# Altium schematic sheet Sheet2.SchDoc
size A3
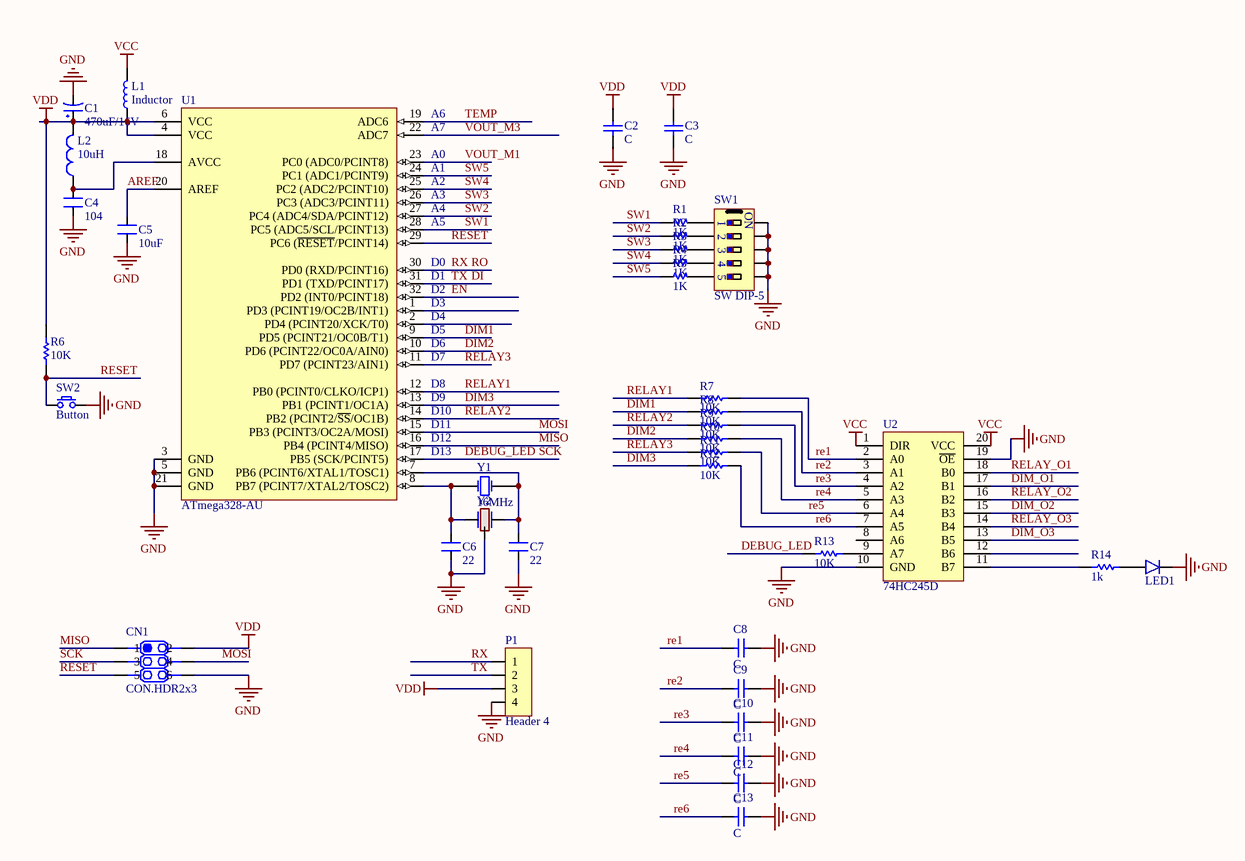
[diagram p0: Sheet2.SchDoc]

## Parts
C1  470uF/16V  [WCAP-PSHP 8x8.7x3.1]
C2  C  [C 0805 (2012)]
C3  C  [C 0805 (2012)]
C4  104  [R 0805 (2012)]
C5  10uF  [R 0805 (2012)]
C6  22  [C 0805 (2012)]
C7  22  [C 0805 (2012)]
C8  C  [C 0805]
C9  C  [C 0805]
C10  C  [C 0805]
C11  C  [C 0805]
C12  C  [C 0805]
C13  C  [C 0805]
CN1  CON.HDR2x3  [Header 3x2]
L1  Inductor  [Inductor SMD 0805 (2012)]
L2  10uH  [R 0805 (2012)]
LED1  Led  [Led SMD 0805]  (value not drawn)
P1  Header 4  [Header 4]
R1  1K  [R 0805]
R2  1K  [R 0805]
R3  1K  [R 0805]
R4  1K  [R 0805]
R5  1K  [R 0805]
R6  10K  [R 0805 (2012)]
R7  10K  [R 0805 (2012)]
R8  10K  [R 0805 (2012)]
R9  10K  [R 0805 (2012)]
R10  10K  [R 0805 (2012)]
R11  10K  [R 0805 (2012)]
R12  10K  [R 0805 (2012)]
R13  10K  [R 0805 (2012)]
R14  1k  [R 0805 (2012)]
SW1  SW DIP-5  [SW/DIP5/300]
SW2  Button  [SW/2/SMD]
U1  ATmega328-AU  [QFP32N]
U2  74HC245D  [SOIC-20]
Y1  16MHz  [XTAL]
Y2  (no value)  [Crystal SMD CSTCE]

## Nets
GND: C1.2 C2.2 C3.2 C4.1 C5.1 C6.1 C7.1 C8.2 C9.2 C10.2 C11.2 C12.2 C13.2 CN1.6 LED1.2(K) P1.4 SW1.6 SW1.7 SW1.8 SW1.9 SW1.10 SW2.2 U1.3(GND) U1.5(GND) U1.21(GND) U2.10(GND) U2.19(~{OE}) Y2.2
VCC: L1.2 U2.1(DIR) U2.20(VCC)
VDD: C1.1 C2.1 C3.1 CN1.2 L1.1 L2.2 P1.3 R6.2 U1.4(VCC) U1.6(VCC)
AREF: C5.2 U1.20(AREF)
DEBUG_LED: CN1.3 R13.1 U1.17(PB5_(SCK/PCINT5))  [also labelled SCK]
DI: P1.2 U1.31(PD1_(TXD/PCINT17))  [also labelled TX]
DIM1: R8.1 U1.9(PD5_(PCINT21/OC0B/T1))
DIM2: R10.1 U1.10(PD6_(PCINT22/OC0A/AIN0))
DIM3: R12.1 U1.13(PB1_(PCINT1/OC1A))
DIM_O1: U2.17(B1)
DIM_O2: U2.15(B3)
DIM_O3: U2.13(B5)
EN: U1.32(PD2_(INT0/PCINT18))
MISO: CN1.1 U1.16(PB4_(PCINT4/MISO))
MOSI: CN1.4 U1.15(PB3_(PCINT3/OC2A/MOSI))
re1: C8.1 R7.2 U2.2(A0)
re2: C9.1 R8.2 U2.3(A1)
re3: C10.1 R9.2 U2.4(A2)
re4: C11.1 R10.2 U2.5(A3)
re5: C12.1 R11.2 U2.6(A4)
re6: C13.1 R12.2 U2.7(A5)
RELAY1: R7.1 U1.12(PB0_(PCINT0/CLKO/ICP1))
RELAY2: R9.1 U1.14(PB2_(PCINT2/~{SS}/OC1B))
RELAY3: R11.1 U1.11(PD7_(PCINT23/AIN1))
RELAY_O1: U2.18(B0)
RELAY_O2: U2.16(B2)
RELAY_O3: U2.14(B4)
RESET: CN1.5 R6.1 SW2.1 U1.29(PC6_(~{RESET}/PCINT14))
RO: P1.1 U1.30(PD0_(RXD/PCINT16))  [also labelled RX]
SW1: R1.1 U1.28(PC5_(ADC5/SCL/PCINT13))
SW2: R2.1 U1.27(PC4_(ADC4/SDA/PCINT12))
SW3: R3.1 U1.26(PC3_(ADC3/PCINT11))
SW4: R4.1 U1.25(PC2_(ADC2/PCINT10))
SW5: R5.1 U1.24(PC1_(ADC1/PCINT9))
TEMP: U1.19(ADC6)
VOUT_M1: U1.23(PC0_(ADC0/PCINT8))
VOUT_M3: U1.22(ADC7)
NetC4_2: C4.2 L2.1 U1.18(AVCC)
NetC6_2: C6.2 U1.8(PB7_(PCINT7/XTAL2/TOSC2)) Y1.1(OSC1) Y2.3
NetC7_2: C7.2 U1.7(PB6_(PCINT6/XTAL1/TOSC1)) Y1.2(OSC2) Y2.1
NetLED1_1: LED1.1(A) R14.2
NetR1_2: R1.2 SW1.1
NetR2_2: R2.2 SW1.2
NetR3_2: R3.2 SW1.3
NetR4_2: R4.2 SW1.4
NetR5_2: R5.2 SW1.5
NetR13_2: R13.2 U2.9(A7)
NetR14_1: R14.1 U2.11(B7)

Not connected (* = marked no-connect by the designer): U1 1(PD3_(PCINT19/OC2B/INT1)) 2(PD4_(PCINT20/XCK/T0)); U2 8(A6) 12(B6)

## Notes on the sheet
- (near U1) A6
- (near U1) A0
- (near U1) A1
- (near U1) A2
- (near U1) A7
- (near U1) A3
- (near U1) A4
- (near U1) A5
- (near U1) D2
- (near U1) D3
- (near U1) D4
- (near U1) D0
- (near U1) D1
- (near U1) D7
- (near U1) D8
- (near U1) D5
- (near U1) D6
- (near U1) D9
- (near U1) D10
- (near U1) D11
- D12
- D13
- (in symbol SW DIP-5) ON

## Library data of the parts
C1 = CP4: Cap 1000uF/16V - 220uF/50V; Description 5: 4,7uF>10uF/250V_3,3uF>10uF/400V - 2,2uF>4,7uF/450V; Description 1: 2200uF-3300uF/6,3V - 1000uF-2200uF/10V; Description 2: 1000uF/16V - 470uF => 1000uF/25V - 100uF/100V; Description 3: 330uF>470uF/35V_220uF>470uF/50V_10uF>22uF/250V; Description 4: 220uF => 330uF/63V - 10uF =>33uF/160 - 200V; Value: 1000uF/16V
C2 C3 C8-C13 = Capacitor NP: Capacitor non-pol
C4 C6 C7 = CN2: Cap np 104 => 105pF; Value: 0.1uF
C5 = CN1: Cap np  1pF - 472pF; Value: 100pF
CN1 = CON.HDR2x3: Header 2x3; Publisher: Hoang Nguyen; ComponentLink1Description: Digikey Part link; ComponentLink2Description: Open DataSheet; ComponentLink2URL: H:\LIBRARY\LIBRARY.Datasheet\
L2 = L1: Inductor; Value: 150 mH
LED1 = Led: Typical LED
P1 = Header 4: Header, 4-Pin
R1-R14 = Resistor
  R6: Published: 8-Jun-2000; LatestRevisionDate: 17-Jul-2002; LatestRevisionNote: Re-released for DXP Platform.; PackageReference: AXIAL-0.3; Publisher: Altium Limited; Value: 10K
  R7-R14: Published: 8-Jun-2000; LatestRevisionDate: 17-Jul-2002; LatestRevisionNote: Re-released for DXP Platform.; PackageReference: AXIAL-0.3; Publisher: Altium Limited
SW2 = SW SPST: Tact switch 2 pin
U1 = ATmega328-AU: 8-bit AVR Microcontroller, 32KB Flash, 1KB EEPROM, 2KB SRAM, 32-pin TQFP, Industrial Grade (-40°C to 85°C); Published: 1-Apr-2010; DatasheetVersion: revA, Jan-2010; PackageVersion: revB, Oct-2001; PackageReference: 32A; Publisher: Altium Limited; PackageDescription: 32-Lead, 7x7x1.0 mm Body, 0.8mm Lead Pitch, Thin Profile Plastic Quad Flat Package (TQFP); Supplier 1: Digi-Key; Supplier Part Number 1: ATMEGA328-AU-ND; Supplier 2: Mouser; Supplier Part Number 2: 556-ATMEGA328-AU; Code_JEDEC: MS-026-ABA; ComponentLink1Description: Manufacturer Link; ComponentLink1URL: http://www.atmel.com/products/avr/default.asp?; ComponentLink2Description: ATmega48A/48PA/88A/88PA/168A/168PA/328/328P Datasheet; ComponentLink2URL: http://www.atmel.com/dyn/resources/prod_documents/8271.pdf; ComponentLink3Description: ATmega48A/48PA/88A/88PA/168A/168PA/328/328P Summary; ComponentLink3URL: http://www.atmel.com/dyn/resources/prod_documents/8271S.pdf; ComponentLink4Description: Atmel.com Home; ComponentLink4URL: http://www.atmel.com
U2 = 74HC245D: IC TRANSCVR NON-INVERT 6V 20SO
Y1 = XTAL: Crystal Oscillator; Published: 8-Jun-2000; LatestRevisionDate: 17-Jul-2002; LatestRevisionNote: Re-released for DXP Platform.; PackageReference: R38; Publisher: Altium Limited
Y2 = Crystal CSTCE